# Altium schematic sheet Microcontroller.SchDoc
size A; SheetNumber: 6; SheetTotal: 9
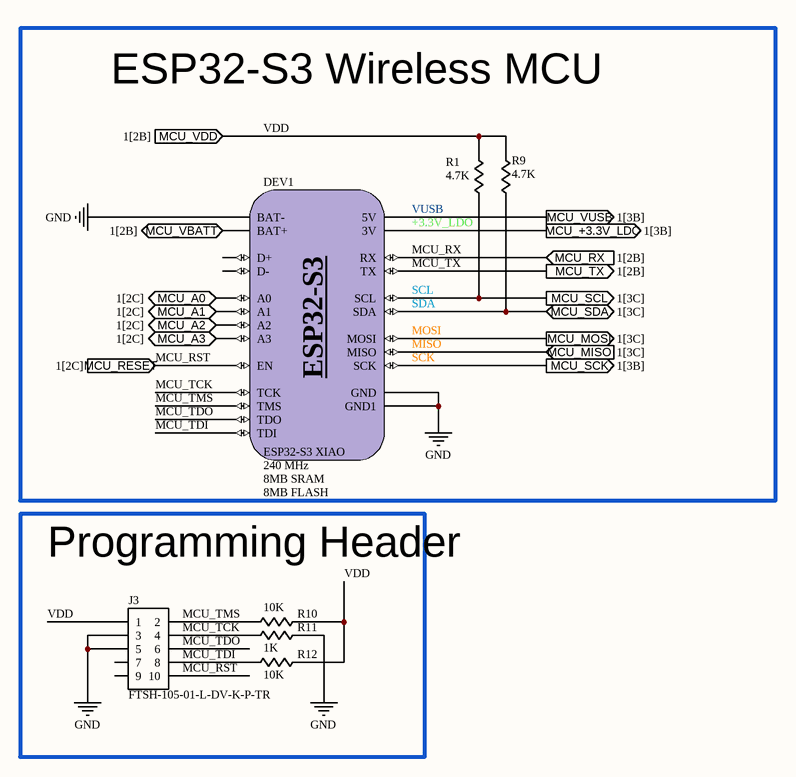
[diagram p0: Microcontroller.SchDoc]

## Parts
DEV1  RAM: 8MB SRAM  Flash: 8MB FLASH  Speed: 240 MHz  Part Number: ESP32-S3 XIAO  [PCB-ESP32-S3-XIAO-SMD]  (hidden comment: MCU-DEV-ESP32-S3-XIAO)
J3  Part Number: FTSH-105-01-L-DV-K-P-TR  [PCB-BOX-HEADER-10PIN-FP-FTSH-105-01-L-DV-K-P-T-MFG]  (hidden comment: CONN-BOX-HDR-10PIN-FTSH-105-01-L-DV-K-P-TR)
R1  value 4.7K  [PCB-RES-SMD-0805]  (hidden comment: RES-SMD-0805)
R9  value 4.7K  [PCB-RES-SMD-0805]  (hidden comment: RES-SMD-0805)
R10  value 10K  [PCB-RES-SMD-0805]  (hidden comment: RES-SMD-0805)
R11  value 1K  [PCB-RES-SMD-0805]  (hidden comment: RES-SMD-0805)
R12  value 10K  [PCB-RES-SMD-0805]  (hidden comment: RES-SMD-0805)

## Blocks framed on the sheet
ESP32-S3 Wireless MCU: DEV1 R1 R9
Programming Header: J3 R10-R12

## Ports
MCU_+3.3V_LDO (out, see 1[3B]), MCU_A0 (bidir, see 1[2C]), MCU_A1 (bidir, see 1[2C]), MCU_A2 (bidir, see 1[2C]), MCU_A3 (bidir, see 1[2C]), MCU_MISO (in, see 1[3C]), MCU_MOSI (out, see 1[3C]), MCU_RESET (in, see 1[2C]), MCU_RX (in, see 1[2B]), MCU_SCK (out, see 1[3B]), MCU_SCL (out, see 1[3C]), MCU_SDA (bidir, see 1[3C]), MCU_TX (out, see 1[2B]), MCU_VBATT (bidir, see 1[2B]), MCU_VDD (in, see 1[2B]), MCU_VUSB (out, see 1[3B])

## Nets
GND: DEV1.BAT- DEV1.GND DEV1.GND1 J3.3 J3.5 R11.2
+3.3V_LDO: DEV1.3V ; port MCU_+3.3V_LDO
MCU_A0: DEV1.A0 ; port MCU_A0
MCU_A1: DEV1.A1 ; port MCU_A1
MCU_A2: DEV1.A2 ; port MCU_A2
MCU_A3: DEV1.A3 ; port MCU_A3
MCU_RST: DEV1.EN J3.10 ; port MCU_RESET
MCU_RX: DEV1.RX ; port MCU_RX
MCU_TCK: DEV1.TCK J3.4 R11.1
MCU_TDI: DEV1.TDI J3.8 R12.1
MCU_TDO: DEV1.TDO J3.6
MCU_TMS: DEV1.TMS J3.2 R10.1
MCU_TX: DEV1.TX ; port MCU_TX
MCU_VBATT: DEV1.BAT+ ; port MCU_VBATT
MISO: DEV1.MISO ; port MCU_MISO
MOSI: DEV1.MOSI ; port MCU_MOSI
SCK: DEV1.SCK ; port MCU_SCK
SCL: DEV1.SCL R1.1 ; port MCU_SCL
SDA: DEV1.SDA R9.1 ; port MCU_SDA
VDD: J3.1 R1.2 R9.2 R10.2 R12.2 ; port MCU_VDD
VUSB: DEV1.5V ; port MCU_VUSB

Not connected (* = marked no-connect by the designer): DEV1 D+ D-; J3 7 9

## Notes on the sheet
- (in symbol CMP-00021-5) ESP32-S3

## Library data of the parts
DEV1 = CMP-00021-5: SMD IC ESP32-S3, Dual-core MCU with WiFi and BLE support.
J3 = CMP-00034-4: Conn Unshrouded Header HDR 10 POS 1.27mm Solder ST Top Entry SMD T/R; Max Current Rating: 1.75A; Number of Positions: 10; Gender: Male; Contact Shape: Square; Flammability Rating: UL94 V-0; Fastening Type: Pull; Length: 6.35mm; RoHS Compliant: Yes; Housing Color: Black; Contact Material: Bronze; Packaging: Tape and Reel; Contact Type: Male Pin; Number of Rows: 2; Contact Plating: Gold; Orientation: Straight; Series: FTSH; Lead Free: Lead Free; Termination: Solder; Number of Contacts: 10; Insulation Color: Black; Pitch: 1.27mm; Housing Material: Polymer; Insulation Material: Polymer; Min Operating Temperature: -55°C; Radiation Hardening: No; Depth: 5.84mm; Max Operating Temperature: 125°C
R1 R9-R12 = CMP-00003-4: Generic (no part number) 0805 surface mount resistor